# EAGLE design d1-mini (EAGLE 9.6.2)
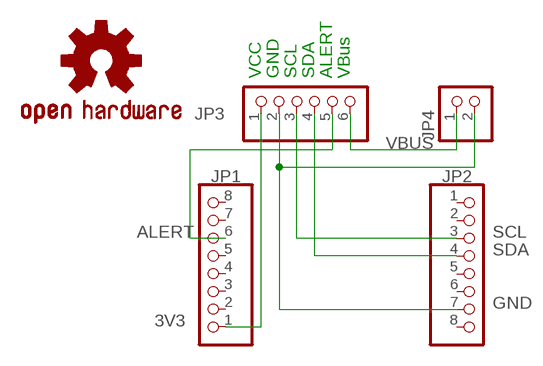
[diagram p0: schematic, sheet 1]

## Parts
JP1  PINHD-1X8  [1X08]
JP2  PINHD-1X8  [1X08]
JP3  PINHD-1X6  [1X06]
JP4  PINHD-1X2/90  [1X02/90]
LOGO1  OSHW-LOGOS  [OSHW-LOGO-S]

## Nets
3V3 [current]: JP1.1 JP3.1
ALERT [signal]: JP1.6 JP3.5
GND [current]: JP2.7 JP3.2 JP4.2
SCL [signal]: JP2.3 JP3.3
SDA [signal]: JP2.4 JP3.4
VBUS [current]: JP3.6 JP4.1
Unconnected: JP1.2 JP1.3 JP1.4 JP1.5 JP1.7 JP1.8 JP2.1 JP2.2 JP2.5 JP2.6 JP2.8

## Notes on the sheet
- VCC | GND | SCL | SDA | ALERT | VBus

## Library data of the parts
JP1 JP2 = pinhead:PINHD-1X8: PIN HEADER
JP3 = pinhead:PINHD-1X6: PIN HEADER
JP4 = pinhead:PINHD-1X2: PIN HEADER
LOGO1 = SparkFun-Aesthetics:OSHW-LOGO: Open-Source Hardware (OSHW) Logo This logo indicates the piece of hardware it is found on incorporates a OSHW license and/or adheres to the definition of open source hardware found here: http://freedomdefined.org/OSHW

## Net classes
1 current: width 0.2 mm
2 signal: width 0.25 mm

## Board
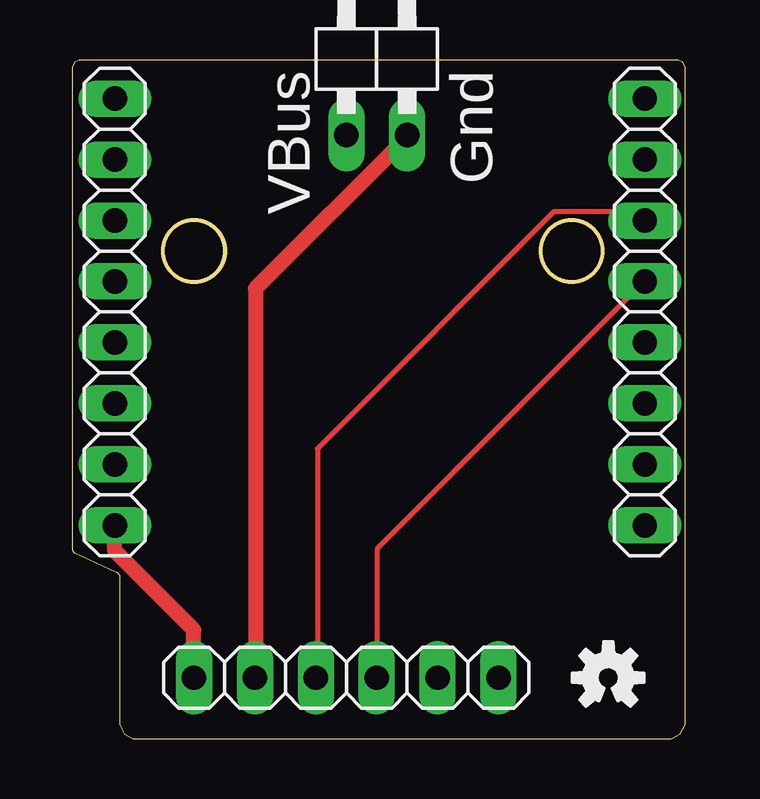
[diagram p1: board, top side]
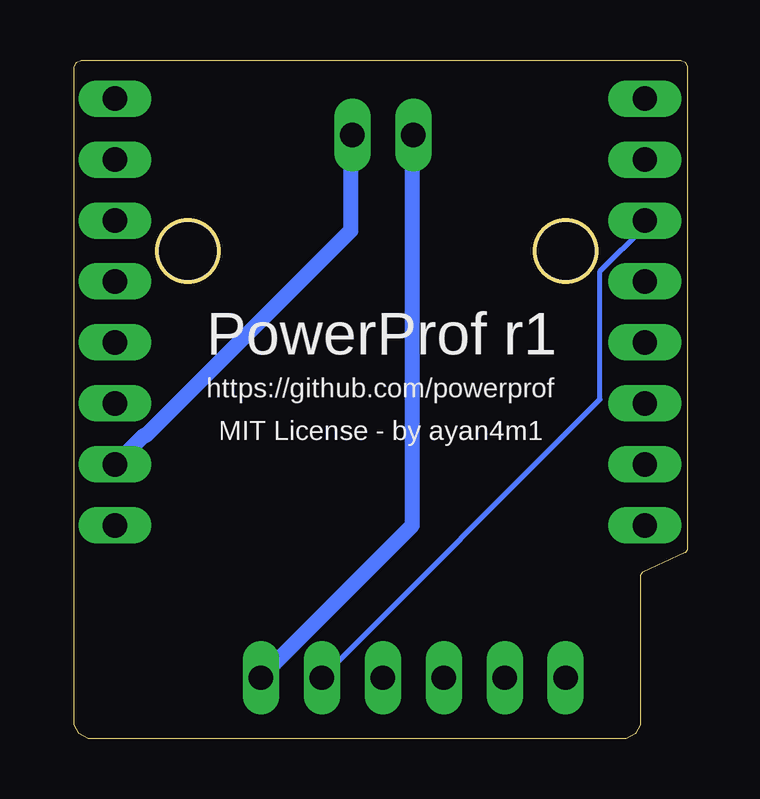
[diagram p2: board, bottom side, seen from below]

Size 25.57 x 28.28 mm. Coordinates in mm from the lower left corner, seen from the top.
Outline: 25.28,28.28 0.29,28.28 0.1,28.18 0,27.99 0,7.88 0.09,7.76 0.11,7.75 1.87,6.94 1.88,6.93 1.97,6.8 1.97,0.58 2.18,0.21 2.55,0 24.99,0 25.36,0.21 25.57,0.58 25.57,27.99 25.47,28.18 25.28,28.28
Outline: circle at 5.08,20.32 radius 1.3
Outline: circle at 20.83,20.32 radius 1.3
Copper layers (1*16): Top 0.0356mm / dielectric 60mil / Bottom 0.0356mm
Design rules "default *": minimum track width 0.01mm, minimum drill 0.35mm, track to track 8mil, track to pad 8mil, pad to pad 8mil, via to via 8mil, smd to smd 8mil, copper to edge 6mil, drill to drill 6mil, minimum pad ring 10mil, minimum via ring 8mil, stop-mask expansion 4mil, vias tented up to drill 0mil, thermal gap 10mil
Holes 2.5 mm at 5.08,20.32 20.83,20.32

### Footprints (pad centres in the part's own frame; a part is rotated, then mirrored left to right if it is on the bottom)
1X08 = drill 1.016 long: 1 -8.89,0; 2 -6.35,0; 3 -3.81,0; 4 -1.27,0; 5 1.27,0; 6 3.81,0; 7 6.35,0; 8 8.89,0
1X06 = drill 1.016 long: 1 -6.35,0; 2 -3.81,0; 3 -1.27,0; 4 1.27,0; 5 3.81,0; 6 6.35,0
1X02/90 = drill 1.016 long: 1 -1.27,-3.81; 2 1.27,-3.81

### Placement (x,y rotation side)
JP1  1.78,17.78 90 top
JP2  23.88,17.78 270 top
JP3  11.43,2.54 0 top
JP4  12.7,28.96 0 top
LOGO1  22.35,2.54 0 top

### Tracks (layer width: path | path; a pad name or v marks a point on that pad's centre or on a via)
3V3
  Top 0.635: JP1.1 1.78,7.82 5.07,4.53 5.07,2.58 JP3.1
ALERT
  Bottom 0.203: JP1.6 1.78,21.34 3.65,19.47 3.65,14.13 JP3.5
GND
  Top 0.635: JP3.2 7.64,2.58 7.64,18.76 13.96,25.07 JP4.2
  Bottom 0.635: JP2.7 23.82,11.47 22.67,12.62 22.58,12.62 14.05,21.16 14.05,25.07 JP4.2
SCL
  Top 0.203: JP3.3 10.22,2.58 10.22,12.09 20.09,21.96 23.47,21.96 23.82,21.6 JP2.3
SDA
  Top 0.203: JP3.4 12.71,2.58 12.71,7.91 23.82,19.02 JP2.4
VBUS
  Bottom 0.635: JP4.1 11.47,25.07 11.47,8.89 17.78,2.58 JP3.6

### Text on the board
bPlace: PowerProf r1 | https://github.com/powerprof
tNames: Gnd | VBus
bNames: MIT License - by ayan4m1